# Altium project 025-Grove0to10VESP.PrjPcb
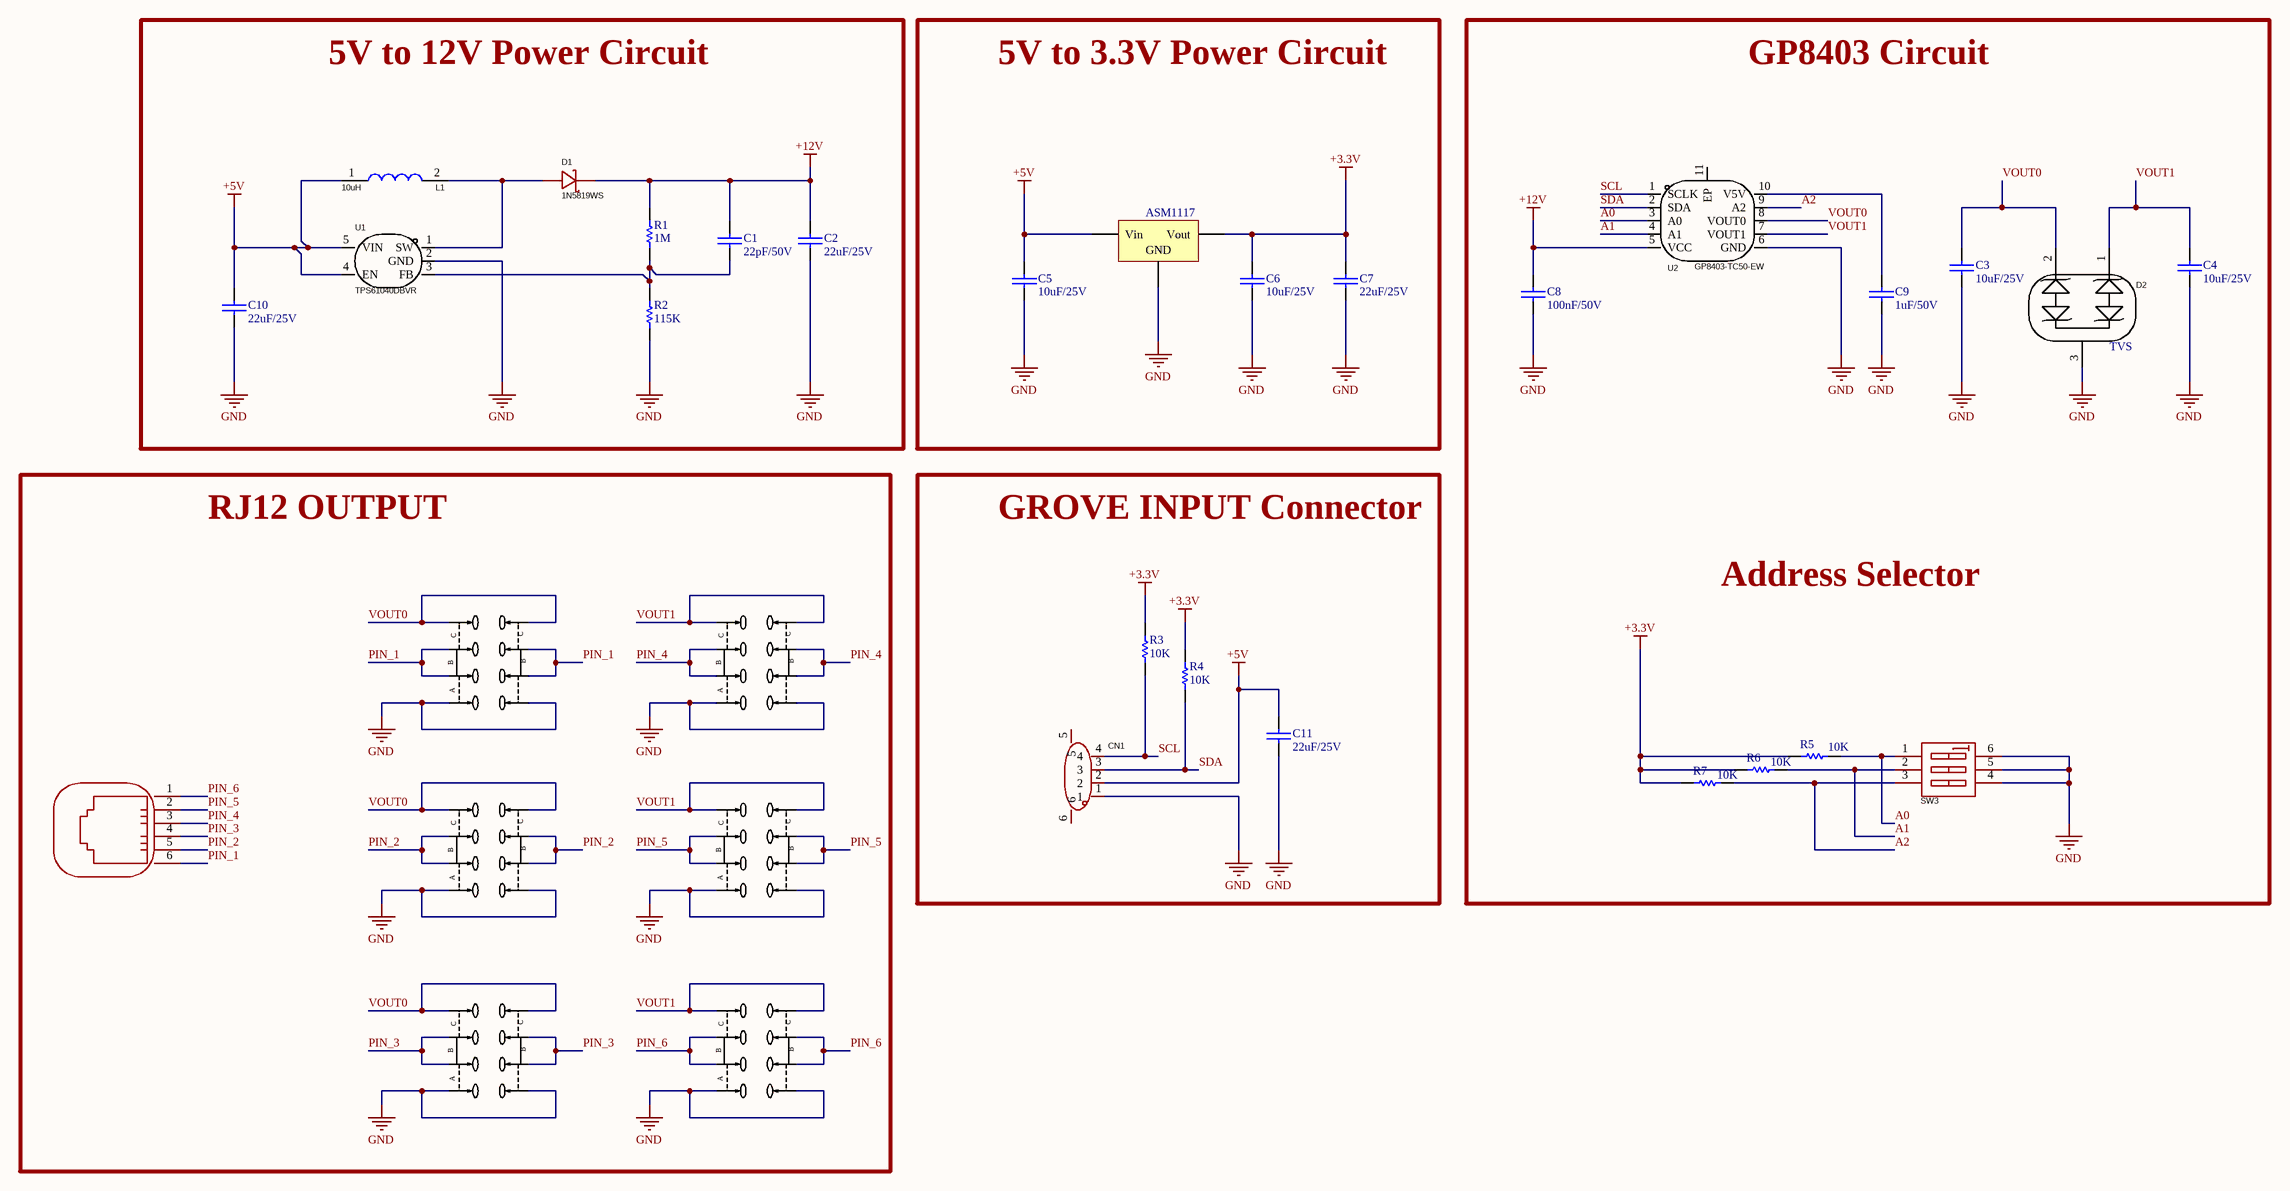
[diagram p0: MainSheet.SchDoc]
1 sheet, 33 parts. Net scope: global (net labels, ports and power ports of the same name join across sheets).
Board file: MainBoard.PcbDoc

## Sheet MainSheet.SchDoc
size A2; SheetNumber: 1; SheetTotal: 1

### Parts
ASM1117  AMS1117 - 3.3V Reg  [SOT229P700X180-4N]  (value not drawn)
C1  22pF/50V  [CAPC2012X08N]
C2  22uF/25V  [CAPC2012X08N]
C3  10uF/25V  [CAPC2012X08N]
C4  10uF/25V  [CAPC2012X08N]
C5  10uF/25V  [CAPC2012X08N]
C6  10uF/25V  [CAPC2012X08N]
C7  22uF/25V  [CAPC2012X08N]
C8  100nF/50V  [CAPC2012X08N]
C9  1uF/50V  [CAPC2012X08N]
C10  22uF/25V  [CAPC2012X08N]
C11  22uF/25V  [CAPC2012X08N]
CN1  ZX-HY2.0-4PWT  [CONN-SMD_4P-P2.00_ZX-HY2.0-4PWT]  (value not drawn)
D1  1N5819WS  [SOD-323_L1.8-W1.3-LS2.5-RD]
D2  TVS  [SOT-23_L2.9-W1.3-P1.90-LS2.4-BR]
L1  10uH  [IND-SMD_L4.5-W4.5_SMMS0420]
R1  1M  [RESC2012X07N]
R2  115K  [RESC2012X07N]
R3  10K  [RESC2012X07N]
R4  10K  [RESC2012X07N]
R5  10K  [RESC2012X07N]
R6  10K  [RESC2012X07N]
R7  10K  [RESC2012X07N]
SW1  MST23D19G2  [SW-SMD_MST23D19G2]  (value not drawn)
SW2  MST23D19G2  [SW-SMD_MST23D19G2]  (value not drawn)
SW3  DSHP03TS-S  [SW-SMD_DSHP03TS-S]  (value not drawn)
SW4  MST23D19G2  [SW-SMD_MST23D19G2]  (value not drawn)
SW5  MST23D19G2  [SW-SMD_MST23D19G2]  (value not drawn)
SW6  MST23D19G2  [SW-SMD_MST23D19G2]  (value not drawn)
SW7  MST23D19G2  [SW-SMD_MST23D19G2]  (value not drawn)
U1  TPS61040DBVR  [SOT-23-5_L3.0-W1.7-P0.95-LS2.8-BL]
U2  GP8403-TC50-EW  [ESSOP-10_L4.9-W3.9-P1.00-LS6.0-BL-EP]
U3  DS1133-S60BPX  [RJ11-TH_DS1133-S60BPX]  (value not drawn)

### Blocks framed on the sheet
5V to 12V Power Circuit: C1 C2 C10 D1 L1 R1 R2 U1
5V to 3.3V Power Circuit: ASM1117 C5-C7
RJ12 OUTPUT: SW1 SW2 SW4-SW7 U3
GROVE INPUT Connector: C11 CN1 R3 R4

### Nets
+3.3V: ASM1117.Vout C6.2 C7.2 R3.2 R4.2 R5.2 R6.2 R7.2
+5V: ASM1117.Vin C5.2 C10.2 C11.2 CN1.2 L1.1 U1.4(EN) U1.5(VIN)
+12V: C1.2 C2.2 C8.2 D1.1(K) R1.2 U2.5(VCC)
GND: ASM1117.GND C2.1 C3.1 C4.1 C5.1 C6.1 C7.1 C8.1 C9.1 C10.1 C11.1 CN1.1 D2.3 R2.1 SW1.1 SW1.8 SW2.1 SW2.8 SW3.4 SW3.5 SW3.6 SW4.1 SW4.8 SW5.1 SW5.8 SW6.1 SW6.8 SW7.1 SW7.8 U1.2(GND) U2.6(GND)
A0: R5.1 SW3.1 U2.3(A0)
A1: R6.1 SW3.2 U2.4(A1)
A2: R7.1 SW3.3 U2.9(A2)
PIN_1: SW1.2 SW1.3 SW1.6 SW1.7 U3.6
PIN_2: SW4.2 SW4.3 SW4.6 SW4.7 U3.5
PIN_3: SW6.2 SW6.3 SW6.6 SW6.7 U3.4
PIN_4: SW2.2 SW2.3 SW2.6 SW2.7 U3.3
PIN_5: SW5.2 SW5.3 SW5.6 SW5.7 U3.2
PIN_6: SW7.2 SW7.3 SW7.6 SW7.7 U3.1
SCL: CN1.4 R3.1 U2.1(SCLK)
SDA: CN1.3 R4.1 U2.2(SDA)
VOUT0: C3.2 D2.2 SW1.4 SW1.5 SW4.4 SW4.5 SW6.4 SW6.5 U2.8(VOUT0)
VOUT1: C4.2 D2.1 SW2.4 SW2.5 SW5.4 SW5.5 SW7.4 SW7.5 U2.7(VOUT1)
NetC1_1: C1.1 R1.1 R2.2 U1.3(FB)
NetC9_2: C9.2 U2.10(V5V)
NetD1_2: D1.2(A) L1.2 U1.1(SW)

Not connected (* = marked no-connect by the designer): CN1 5 6; U2 11(EP)

### Notes on the sheet
- GP8403 Circuit
- Address Selector
- (in symbol MST23D19G2) C; B; A

### Library data of the parts
ASM1117 = AMS1117 - 3.3V Reg: C6186; Created By: NourAldin
C1 = 0805 capacitor: C105623; CreatedBy: NourAldin; Mouser Link: https://eu.mouser.com/ProductDetail/KEMET/C0805C102MAREC7210?qs=sGAEpiMZZMs0AnBnWHyRQN7%2fAA2D2lPPn4aJ8HP1TBffR9FQG0oqCQ%3d%3d; DataSheet: https://eu.mouser.com/datasheet/2/212/KEM_C1090_X7R_ESD-1103328.pdf
C2 C7 C10 C11 = 0805 capacitor: C602037; CreatedBy: NourAldin; Mouser Link: https://eu.mouser.com/ProductDetail/KEMET/C0805C102MAREC7210?qs=sGAEpiMZZMs0AnBnWHyRQN7%2fAA2D2lPPn4aJ8HP1TBffR9FQG0oqCQ%3d%3d; DataSheet: https://eu.mouser.com/datasheet/2/212/KEM_C1090_X7R_ESD-1103328.pdf
C3-C6 = 0805 capacitor: C15850; CreatedBy: NourAldin; Mouser Link: https://eu.mouser.com/ProductDetail/KEMET/C0805C102MAREC7210?qs=sGAEpiMZZMs0AnBnWHyRQN7%2fAA2D2lPPn4aJ8HP1TBffR9FQG0oqCQ%3d%3d; DataSheet: https://eu.mouser.com/datasheet/2/212/KEM_C1090_X7R_ESD-1103328.pdf
C8 = 0805 capacitor: C49678; CreatedBy: NourAldin; Mouser Link: https://eu.mouser.com/ProductDetail/KEMET/C0805C102MAREC7210?qs=sGAEpiMZZMs0AnBnWHyRQN7%2fAA2D2lPPn4aJ8HP1TBffR9FQG0oqCQ%3d%3d; DataSheet: https://eu.mouser.com/datasheet/2/212/KEM_C1090_X7R_ESD-1103328.pdf
C9 = 0805 capacitor: C28323; CreatedBy: NourAldin; Mouser Link: https://eu.mouser.com/ProductDetail/KEMET/C0805C102MAREC7210?qs=sGAEpiMZZMs0AnBnWHyRQN7%2fAA2D2lPPn4aJ8HP1TBffR9FQG0oqCQ%3d%3d; DataSheet: https://eu.mouser.com/datasheet/2/212/KEM_C1090_X7R_ESD-1103328.pdf
CN1 = ZX-HY2.0-4PWT: C7429571; Manufacturer: Megastar(兆星); Add into BOM: yes; Pins Structure: 1x4P; Pitch: 2mm; Reference Series: HY; Number of PINs Per Row: 4; Current Rating: 2A; Supplementary Features: Auxiliary Solder Pin; Z-Height of the Board: 5.2mm; X-Length of Bottom Edge on Board (Spacing Line): 12mm; Y-Width of Bottom Edge on Board: 10.5mm; Symbol: ZX-HY2.0-4PWT; Device: ZX-HY2.0-4PWT; LCSC Part Name: 1x4P 间距:2mm 卧贴 系列:HY; Supplier Part: C7429571; Manufacturer Part: ZX-HY2.0-4PWT; Supplier Footprint: SMD,P=2mm,卧贴; JLCPCB Part Class: Extended Part; Datasheet: https://item.szlcsc.com/datasheet/ZX-HY2.0-4PWT/8427488.html; Supplier: LCSC; Convert to PCB: yes; Mounting Type: Surface Mount, Right Angle; Number of Pins: 4P; Number of Rows: 1; Row Spacing: -; Contact Material: Brass; Contact Plating: Tin; Operating Temperature: -25℃~+85℃; Voltage Rating: -; Plastic Material: -; Flame Retardant Rating: -; Color: Beige
D1 = 1N5819WS_C191023: C191023; Manufacturer: Hottech(合科泰); Add into BOM: yes; Voltage - Forward(Vf@If): 600mV@1A; Voltage - DC Reverse(Vr): 40V; Current - Rectified: 1A; Non-Repetitive Peak Forward Surge Current: 25A; Symbol: 1N5819WS; Device: 1N5819WS_C191023; LCSC Part Name: 电压:40V 电流:1A; Supplier Part: C191023; Manufacturer Part: 1N5819WS; Supplier Footprint: SOD-323; JLCPCB Part Class: Basic Part; Datasheet: https://item.szlcsc.com/datasheet/1N5819WS/213850.html; Supplier: LCSC; Convert to PCB: yes
D2 = TVS 2 Channel: C2892527; Manufacturer: Littelfuse(美国力特); Symbol: SM712-02HTG; Device: SM712-02HTG_C172881; Add into BOM: yes; polarity: Bi-Directional; Reverse Stand-Off Voltage (Vrwm): 12V@Max；7V@Max; Maximum Clamping Voltage: 31V；19V; Peak Pulse Current (Ipp)@10/1000us: 19A@8/20us; Peak Pulse Power Dissipation (Ppp)@10/1000us: 600W; Breakdown Voltage: 13.3V；7.5V; LCSC Part Name: SM712-02HTG; Supplier Part: C172881; Manufacturer Part: SM712-02HTG; Supplier Footprint: SOT-23; JLCPCB Part Class: Extended Part; Datasheet: https://atta.szlcsc.com/upload/public/pdf/source/20180725/C172881_EAAF30934B5110668A16259EFFDDCCE9.pdf; Supplier: LCSC; Convert to PCB: yes; Type: TVS
L1 = SMMS0420-100M: C133195; Manufacturer: SXN(顺翔诺); Add into BOM: yes; Tolerance: ±20%; Current Rating: 1.6A; Current - Saturation(Isat): 2A; DC Resistance(DCR): 258mΩ; Symbol: SMMS0420-100M; Device: SMMS0420-100M; LCSC Part Name: 10uH ±20% 2A; Supplier Part: C133195; Manufacturer Part: SMMS0420-100M; Supplier Footprint: SMD,4.6x4.2mm; JLCPCB Part Class: Extended Part; Datasheet: https://item.szlcsc.com/datasheet/SMMS0420-100M/144499.html; Supplier: LCSC; Convert to PCB: yes; Value: 10uH; Type: -
R1 = 0805 Resistor: C107700; Created By: NourAldin; Mouser Link: https://eu.mouser.com/ProductDetail/ROHM-Semiconductor/KTR10EZPF3921?qs=493kPxzlxfJ9hgmf1BrSoQ%3d%3d; DataSheet: https://eu.mouser.com/datasheet/2/348/ktr-e-1139187.pdf
R2 = 0805 Resistor: C2933289; Created By: NourAldin; Mouser Link: https://eu.mouser.com/ProductDetail/ROHM-Semiconductor/KTR10EZPF3921?qs=493kPxzlxfJ9hgmf1BrSoQ%3d%3d; DataSheet: https://eu.mouser.com/datasheet/2/348/ktr-e-1139187.pdf
R3-R7 = 0805 Resistor: C84376; Created By: NourAldin; Mouser Link: https://eu.mouser.com/ProductDetail/ROHM-Semiconductor/KTR10EZPF3921?qs=493kPxzlxfJ9hgmf1BrSoQ%3d%3d; DataSheet: https://eu.mouser.com/datasheet/2/348/ktr-e-1139187.pdf
SW1 SW2 SW4-SW7 = MST23D19G2: C431545; Manufacturer: SHOU HAN(首韩); Add into BOM: yes; Circuit: 双刀三掷; Pin Style: SMDSplicing; Switch Length: 12.95mm; Switch Width: 3.55mm; Switch Height: 3.5mm; Current Rating (DC): 100mA; Voltage Rating (DC): 12V; Mechanical Life: 1万次; Symbol: MST23D19G2; Device: MST23D19G2; LCSC Part Name: 三档立式贴片 8脚拨动 柄长2.0MM; Supplier Part: C431545; Manufacturer Part: MST23D19G2; Supplier Footprint: SMD; JLCPCB Part Class: Extended Part; Datasheet: https://atta.szlcsc.com/upload/public/pdf/source/20190925/C431545_A88710AC241B275593C257CF6D595AD7.pdf; Supplier: LCSC; Convert to PCB: yes; Actuator Style: -; Mounting Style: Brick nogging; Actuator Color: -; Current Rating (AC): -; Voltage Rating (AC): -; Operating Temperature: -25℃~+70℃
SW3 = DSHP03TS-S: C319051; Manufacturer: XKB Connection(中国星坤); Add into BOM: yes; Circuit: SPST; Number of Positions: 3; Current Rating: 25mA; Voltage Rating: 24V; Operating Life: 3,000 Cycles; Symbol: DSHP03TS-S; Device: DSHP03TS-S; LCSC Part Name: 间距1.27mm 平拨,凹槽式 3位拨码开关; Supplier Part: C319051; Manufacturer Part: DSHP03TS-S; Supplier Footprint: SMD-6P,5.4x5.4mm; JLCPCB Part Class: Extended Part; Datasheet: https://item.szlcsc.com/datasheet/DSHP03TS-S/300143.html; Supplier: LCSC; Convert to PCB: yes; Type: Slide, Recessed; Termination Style: Gull Wing; Lead Pitch: 1.27mm; Operating Temperature: -20℃~+70℃; Color: Black
U1 = TPS61040DBVR: C7722; Manufacturer: TI(德州仪器); Add into BOM: yes; Function: Boost type; Output Type: Adjustable; Input Voltage: 1.8V~6V; Output Voltage: 28V; Output Current: 400mA; Switching Frequency: 1MHz; Synchronous Rectification: No; Number of Outputs: 1; Topology: Boost; Quiescent Current (Iq): 28uA; Switch tube (built-in/external): Built-in; Symbol: TPS61040DBVR; Device: TPS61040DBVR; LCSC Part Name: 低功耗DC/DC升压转换器; Supplier Part: C7722; Manufacturer Part: TPS61040DBVR; Supplier Footprint: SOT-23-5; JLCPCB Part Class: Extended Part; Datasheet: https://www.ti.com/cn/lit/gpn/tps61040; Supplier: LCSC; Convert to PCB: yes; Operating Temperature: -40℃~+85℃
U2 = GP8403-TC50-EW: C3152007; Manufacturer: Guestgood(客益); Symbol: GP8403-TC50-EW_C3152007; Add into BOM: yes; Device: GP8403-TC50-EW; LCSC Part Name: 双路0-10V (0.1%); Supplier Part: C3152007; Manufacturer Part: GP8403-TC50-EW; Supplier Footprint: ESSOP-10-150mil; JLCPCB Part Class: Extended Part; Datasheet: https://item.szlcsc.com/datasheet/GP8403-TC50-EW/3713796.html; Supplier: LCSC; Convert to PCB: yes
U3 = DS1133-S60BPX: C77859; Manufacturer: CONNFLY; Add into BOM: yes; Connector Type: RJ12 Jack; Number of Ports: 1; Symbol: DS1133-S60BPX; Device: DS1133-S60BPX; LCSC Part Name: DS1133-S60BPX; Supplier Part: C77859; Manufacturer Part: DS1133-S60BPX; Supplier Footprint: 插件; JLCPCB Part Class: Extended Part; Datasheet: https://item.szlcsc.com/datasheet/DS1133-S60BPX/78993.html; Supplier: LCSC; Convert to PCB: yes; LED: -; Shielding: -; Ratings: -